# Altium project BanalceCar_CCD_Base.PrjPCB
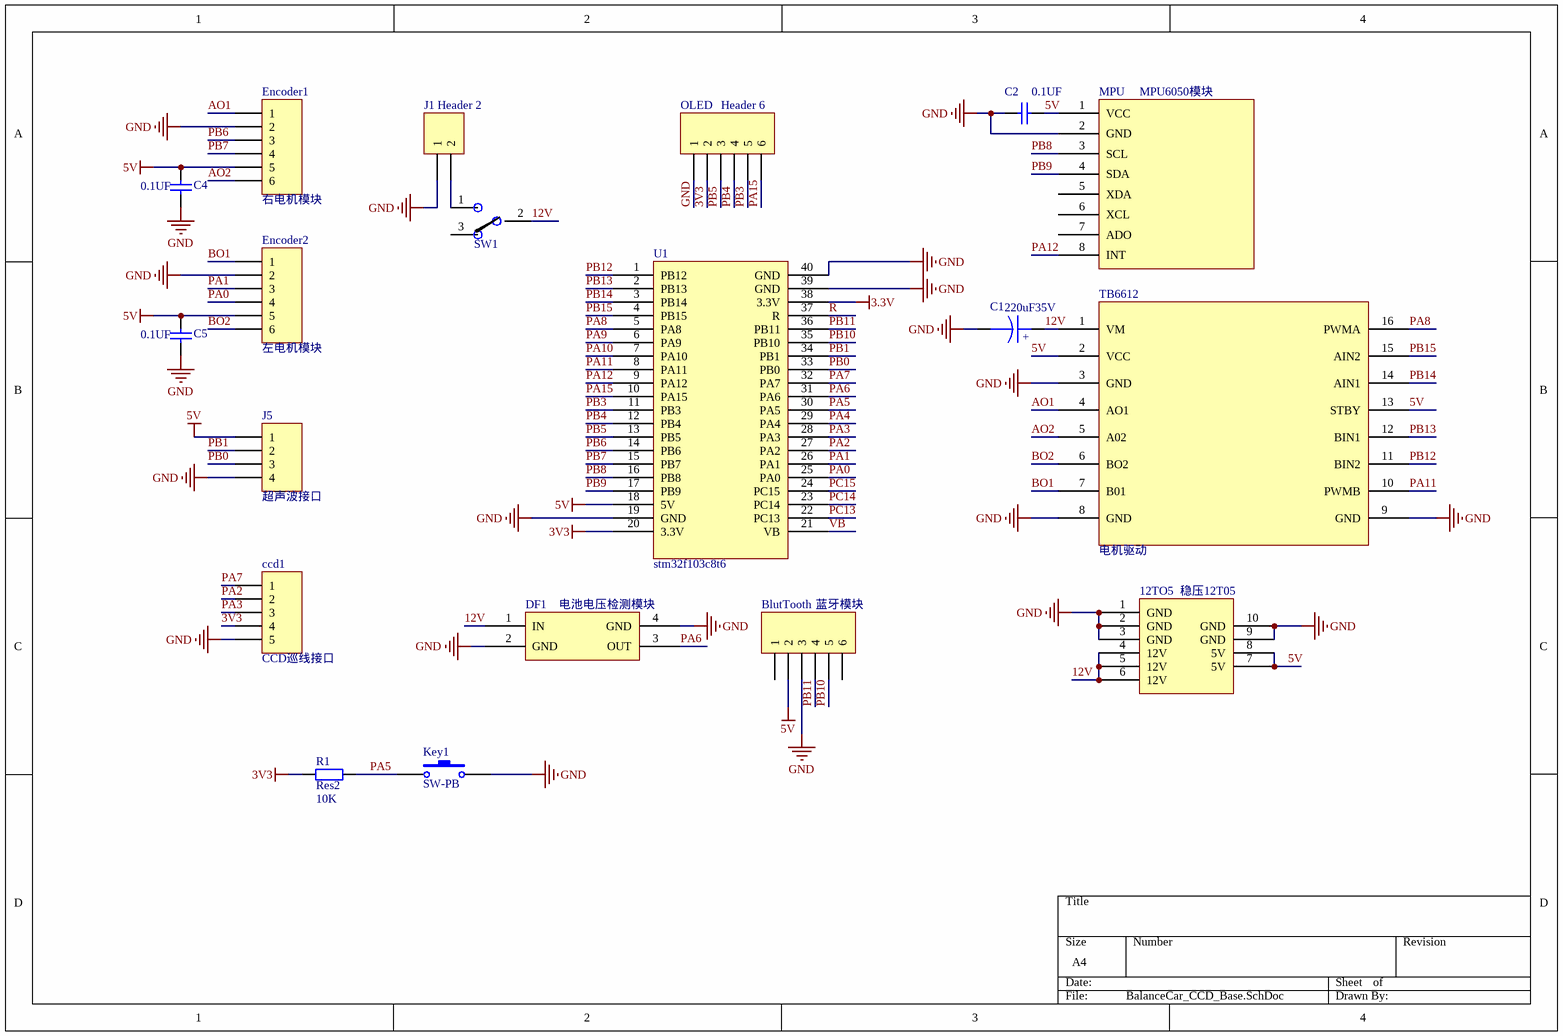
[diagram p0: BalanceCar_CCD_Base.SchDoc]
1 sheet, 19 parts. Net scope: global (net labels, ports and power ports of the same name join across sheets).
Board file: BalanceCar_CCD_Base.PcbDoc

## Sheet BalanceCar_CCD_Base.SchDoc
size A4

### Parts
12TO5  稳压12T05  [稳压12T05]
BlutTooth  蓝牙模块  [HDR1X6 - XH弯]
C1  220uF35V  [CAP-820uF-6.3V]
C2  0.1UF  [Cap-CP]
C4  0.1UF  [Cap-CP]
C5  0.1UF  [Cap-CP]
ccd1  CCD巡线接口  [CCD5]
DF1  电池电压检测模块  [DF - 2]
Encoder1  右电机模块  [HDR1X6 - XH弯]
Encoder2  左电机模块  [HDR1X6 - XH弯]
J1  Header 2  [T HEAD]
J5  超声波接口  [HDR1X4]
Key1  SW-PB  [KEY]
MPU  MPU6050模块  [6050new]
OLED  Header 6  [OLED6]
R1  Res2  value 10K  [AXIAL-0.4]
SW1  SW-SPDT  [SS12d11拨动电源开关]  (value not drawn)
TB6612  电机驱动  [TB6612DIP]
U1  stm32f103c8t6  [PCBComponent_1 - duplicate]

### Nets
3.3V: U1.38(3.3V)
3V3: ccd1.4 OLED.2 R1.1 U1.20(3.3V)
5V: 12TO5.7(5V) 12TO5.8(5V) BlutTooth.2 C2.2 C4.2 C5.2 Encoder1.5 Encoder2.5 J5.1 MPU.1(VCC) TB6612.2(VCC) TB6612.13(STBY) U1.18(5V)
GND: 12TO5.1(GND) 12TO5.2(GND) 12TO5.3(GND) 12TO5.9(GND) 12TO5.10(GND) BlutTooth.3 C1.2 C2.1 C4.1 C5.1 ccd1.5 DF1.2(GND) DF1.4(GND) Encoder1.2 Encoder2.2 J1.1 J5.4 Key1.2 MPU.2(GND) OLED.1 TB6612.3(GND) TB6612.8(GND) TB6612.9(GND) U1.19(GND) U1.39(GND) U1.40(GND)
12V: 12TO5.4(12V) 12TO5.5(12V) 12TO5.6(12V) C1.1 DF1.1(IN) SW1.2 TB6612.1(VM)
AO1: Encoder1.1 TB6612.4(AO1)
AO2: Encoder1.6 TB6612.5(A02)
BO1: Encoder2.1 TB6612.7(B01)
BO2: Encoder2.6 TB6612.6(BO2)
PA0: Encoder2.4 U1.25(PA0)
PA1: Encoder2.3 U1.26(PA1)
PA2: ccd1.2 U1.27(PA2)
PA3: ccd1.3 U1.28(PA3)
PA4: U1.29(PA4)
PA5: Key1.1 R1.2 U1.30(PA5)
PA6: DF1.3(OUT) U1.31(PA6)
PA7: ccd1.1 U1.32(PA7)
PA8: TB6612.16(PWMA) U1.5(PA8)
PA9: U1.6(PA9)
PA10: U1.7(PA10)
PA11: TB6612.10(PWMB) U1.8(PA11)
PA12: MPU.8(INT) U1.9(PA12)
PA15: OLED.6 U1.10(PA15)
PB0: J5.3 U1.33(PB0)
PB1: J5.2 U1.34(PB1)
PB3: OLED.5 U1.11(PB3)
PB4: OLED.4 U1.12(PB4)
PB5: OLED.3 U1.13(PB5)
PB6: Encoder1.3 U1.14(PB6)
PB7: Encoder1.4 U1.15(PB7)
PB8: MPU.3(SCL) U1.16(PB8)
PB9: MPU.4(SDA) U1.17(PB9)
PB10: BlutTooth.5 U1.35(PB10)
PB11: BlutTooth.4 U1.36(PB11)
PB12: TB6612.11(BIN2) U1.1(PB12)
PB13: TB6612.12(BIN1) U1.2(PB13)
PB14: TB6612.14(AIN1) U1.3(PB14)
PB15: TB6612.15(AIN2) U1.4(PB15)
PC13: U1.22(PC13)
PC14: U1.23(PC14)
PC15: U1.24(PC15)
R: U1.37(R)
VB: U1.21(VB)
NetJ1_2: J1.2 SW1.1

Not connected (* = marked no-connect by the designer): BlutTooth 1 6; MPU 5(XDA) 6(XCL) 7(ADO); SW1 3

### Notes on the sheet
- (in symbol CAPACITOR POL) +

### Library data of the parts
BlutTooth Encoder1 Encoder2 = Header 6: 不用焊; LatestRevisionDate: 17-Jul-2002; LatestRevisionNote: Re-released for DXP Platform.; Publisher: Altium Limited
C1 = CAPACITOR POL: Capacitor
C2 C4 C5 = Cap: Capacitor; Published: 8-Jun-2000; LatestRevisionDate: 17-Jul-2002; LatestRevisionNote: Re-released for DXP Platform.; PackageReference: RAD-0.3; Publisher: Altium Limited
ccd1 = Header 5: Header, 5-Pin; LatestRevisionDate: 17-Jul-2002; LatestRevisionNote: Re-released for DXP Platform.; Publisher: Altium Limited
DF1 = 电阻分压测量电量
J1 = Header 2: Header, 2-Pin; LatestRevisionDate: 17-Jul-2002; LatestRevisionNote: Re-released for DXP Platform.; Publisher: Altium Limited
J5 = Header 4: Header, 4-Pin; LatestRevisionDate: 17-Jul-2002; LatestRevisionNote: Re-released for DXP Platform.; Publisher: Altium Limited
Key1 = SW-PB: Switch; Published: 24-Mar-1999; LatestRevisionDate: 17-Jul-2002; LatestRevisionNote: Re-released for DXP Platform.; PackageReference: SPST-2; Publisher: Altium Limited; PackageDescription: Switch; 2 Leads
OLED = Header 6: Header, 6-Pin; LatestRevisionDate: 17-Jul-2002; LatestRevisionNote: Re-released for DXP Platform.; Publisher: Altium Limited
R1 = Res2: Resistor; Published: 8-Jun-2000; LatestRevisionDate: 17-Jul-2002; LatestRevisionNote: Re-released for DXP Platform.; PackageReference: AXIAL-0.4; Publisher: Altium Limited; PackageDescription: Axial Device, Thru-Hole; 2 Leads; 0.4 in Pin Spacing
SW1 = SW-SPDT: 单刀双掷开关
TB6612 = TB6612
U1 = Component_1_1